# Altium schematic sheet 06_SAMA7G54-PIO.SchDoc
size 420 x 297 mm; SheetNumber: 28; SheetTotal: 29
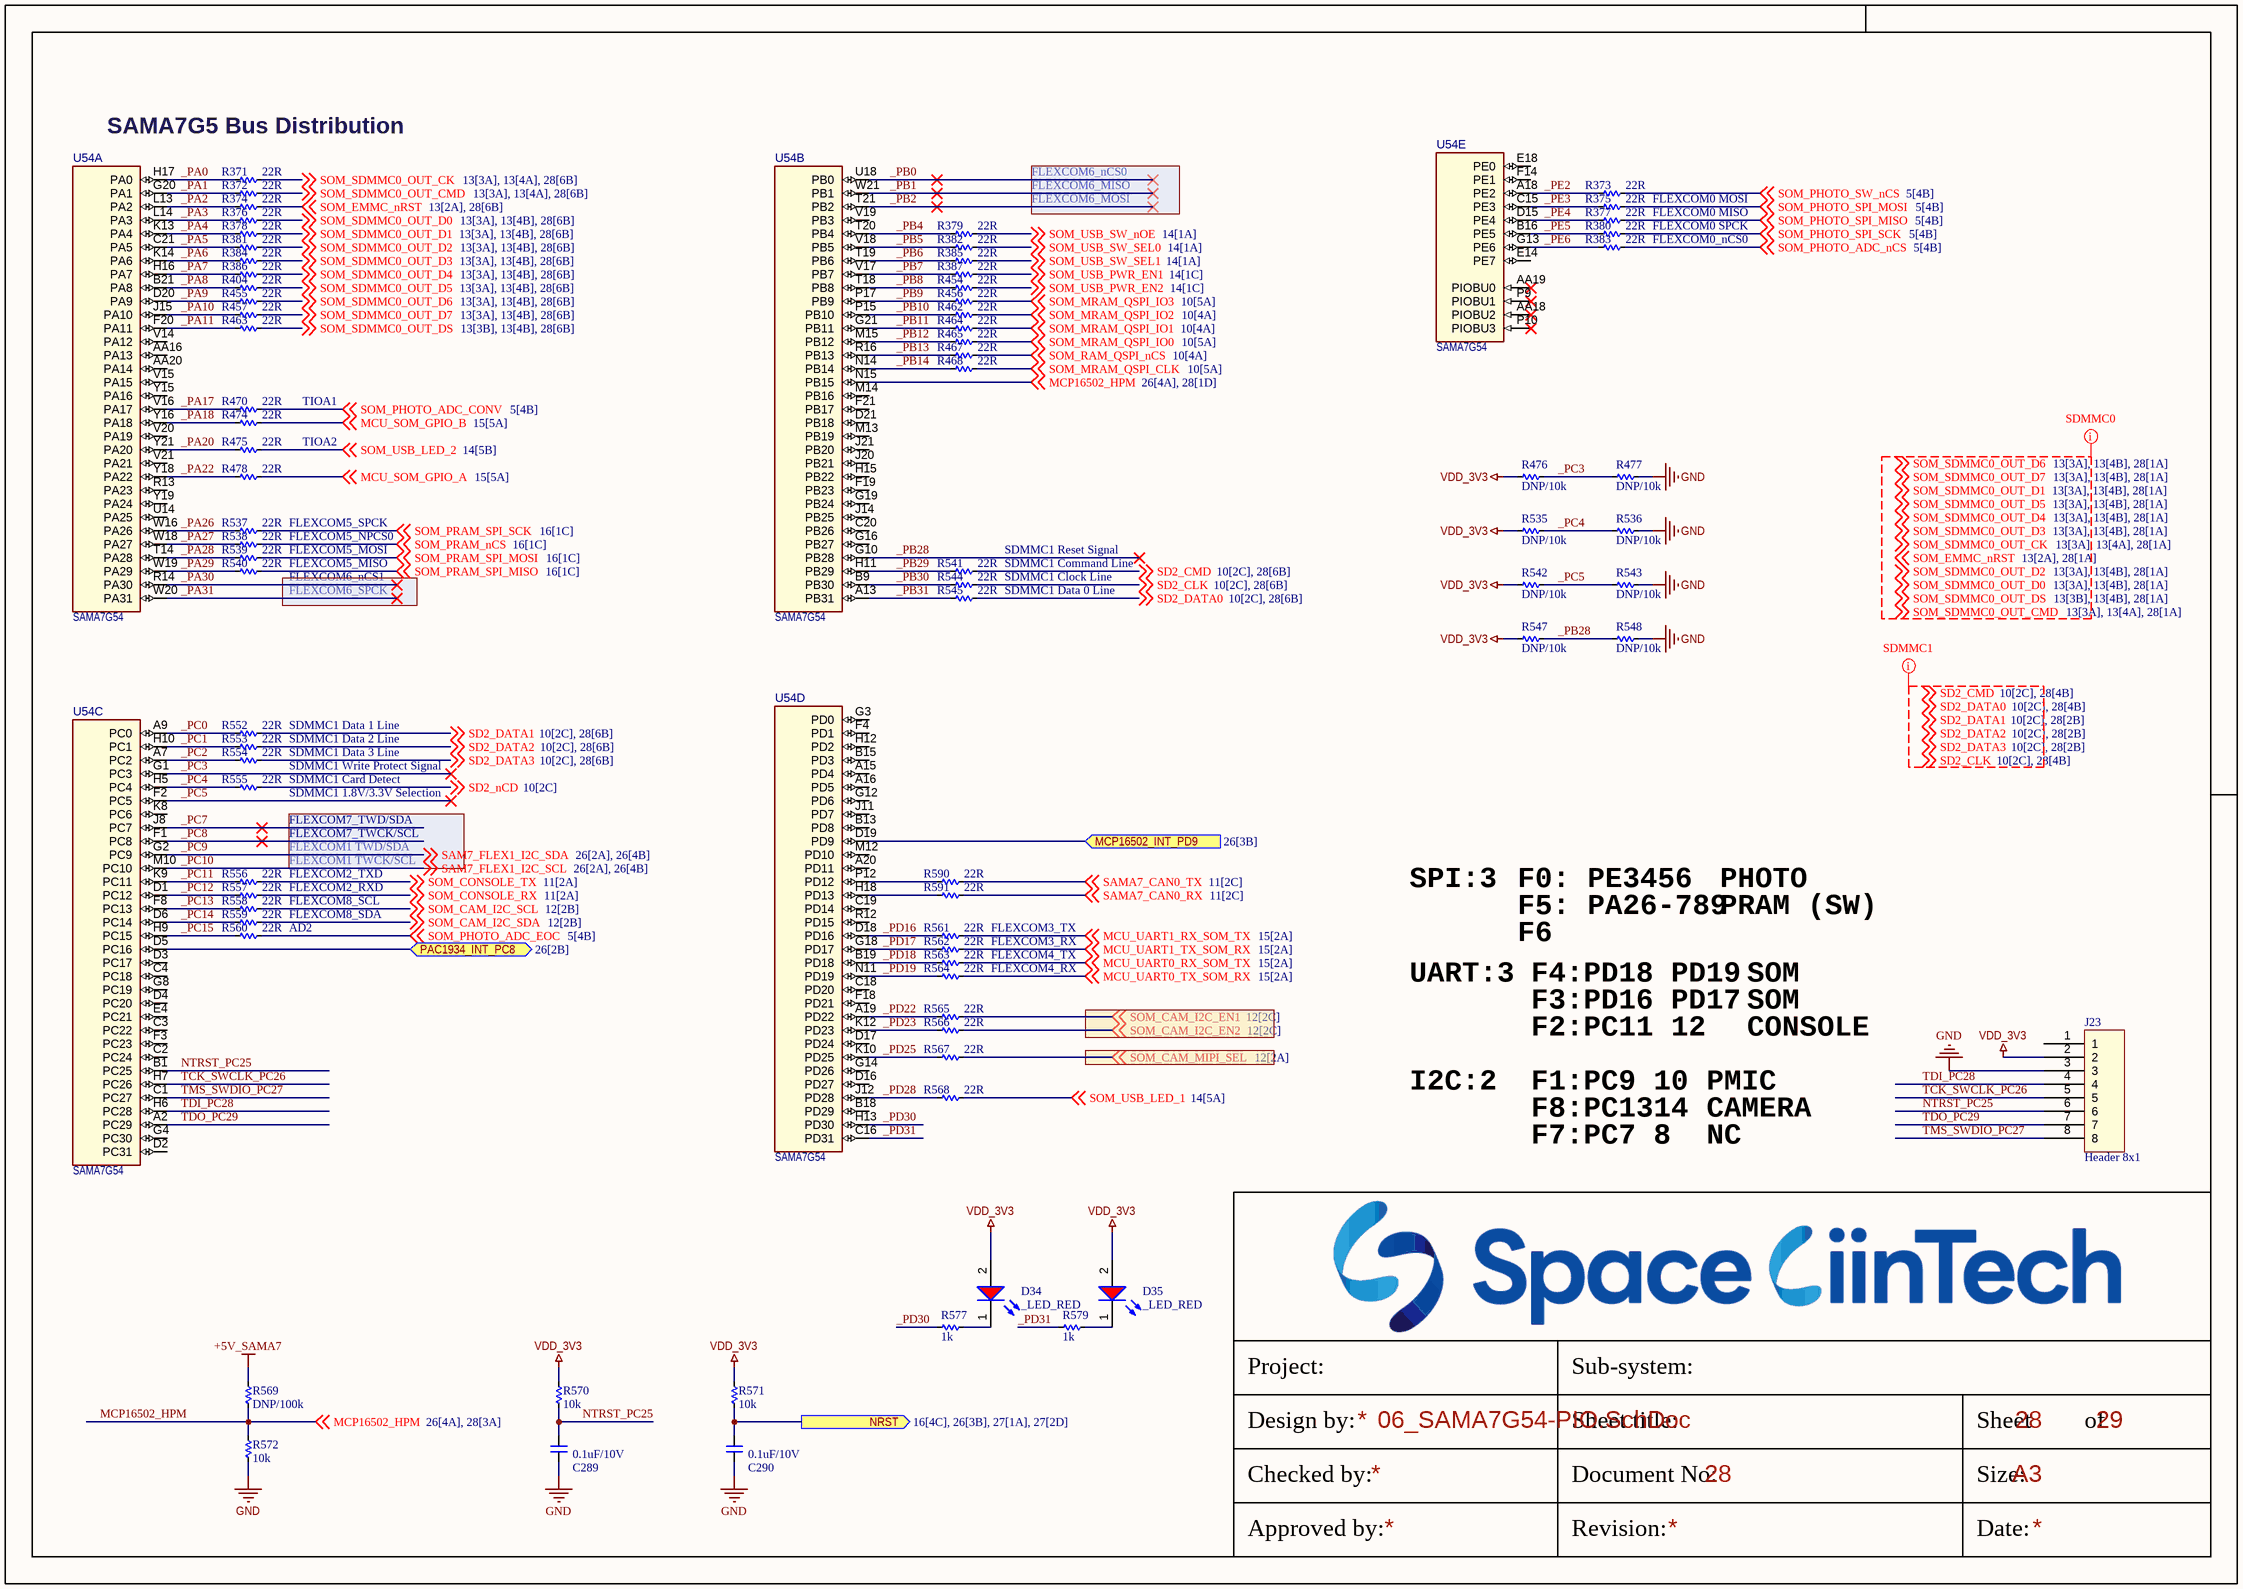
[diagram p0: 06_SAMA7G54-PIO.SchDoc]

## Parts
C289  0.1uF/10V  [CAP_C_1005X60]
C290  0.1uF/10V  [CAP_C_1005X60]
D34  _LED_RED  [LED_0603]
D35  _LED_RED  [LED_0603]
J23  Header 8x1  [Header_254P_8x1]
R371  22R  [RES_C_0603X30]
R372  22R  [RES_C_0603X30]
R373  22R  [RES_C_0603X30]
R374  22R  [RES_C_0603X30]
R375  22R  [RES_C_0603X30]
R376  22R  [RES_C_0603X30]
R377  22R  [RES_C_0603X30]
R378  22R  [RES_C_0603X30]
R379  22R  [RES_C_0603X30]
R380  22R  [RES_C_0603X30]
R381  22R  [RES_C_0603X30]
R382  22R  [RES_C_0603X30]
R383  22R  [RES_C_0603X30]
R384  22R  [RES_C_0603X30]
R385  22R  [RES_C_0603X30]
R386  22R  [RES_C_0603X30]
R387  22R  [RES_C_0603X30]
R404  22R  [RES_C_0603X30]
R454  22R  [RES_C_0603X30]
R455  22R  [RES_C_0603X30]
R456  22R  [RES_C_0603X30]
R457  22R  [RES_C_0603X30]
R462  22R  [RES_C_0603X30]
R463  22R  [RES_C_0603X30]
R464  22R  [RES_C_0603X30]
R465  22R  [RES_C_0603X30]
R467  22R  [RES_C_0603X30]
R468  22R  [RES_C_0603X30]
R470  22R  [RES_C_0603X30]
R474  22R  [RES_C_0603X30]
R475  22R  [RES_C_0603X30]
R476  DNP/10k  [RES_C_1005X40]
R477  DNP/10k  [RES_C_1005X40]
R478  22R  [RES_C_0603X30]
R535  DNP/10k  [RES_C_1005X40]
R536  DNP/10k  [RES_C_1005X40]
R537  22R  [RES_C_0603X30]
R538  22R  [RES_C_0603X30]
R539  22R  [RES_C_0603X30]
R540  22R  [RES_C_0603X30]
R541  22R  [RES_C_0603X30]
R542  DNP/10k  [RES_C_1005X40]
R543  DNP/10k  [RES_C_1005X40]
R544  22R  [RES_C_0603X30]
R545  22R  [RES_C_0603X30]
R547  DNP/10k  [RES_C_1005X40]
R548  DNP/10k  [RES_C_1005X40]
R552  22R  [RES_C_0603X30]
R553  22R  [RES_C_0603X30]
R554  22R  [RES_C_0603X30]
R555  22R  [RES_C_0603X30]
R556  22R  [RES_C_0603X30]
R557  22R  [RES_C_0603X30]
R558  22R  [RES_C_0603X30]
R559  22R  [RES_C_0603X30]
R560  22R  [RES_C_0603X30]
R561  22R  [RES_C_0603X30]
R562  22R  [RES_C_0603X30]
R563  22R  [RES_C_0603X30]
R564  22R  [RES_C_0603X30]
R565  22R  [RES_C_0603X30]
R566  22R  [RES_C_0603X30]
R567  22R  [RES_C_0603X30]
R568  22R  [RES_C_0603X30]
R569  DNP/100k  [RES_C_1005X40]
R570  10k  [RES_C_1005X40]
R571  10k  [RES_C_1005X40]
R572  10k  [RES_C_1005X40]
R577  1k  [RES_C_1005X40]
R579  1k  [RES_C_1005X40]
R590  22R  [RES_C_0603X30]
R591  22R  [RES_C_0603X30]
U54  SAMA7G54  [TFBGA-343_14x14]  (parts A,B,C,D,E of 8)

## Ports
MCP16502_INT_PD9 (in, see 26[3B]), NRST (out, see 16[4C], 26[3B], 27[1A], 27[2D]), PAC1934_INT_PC8 (bidir, see 26[2B])

## Nets
+5V_SAMA7: R569.1
GND: C289.1 C290.1 J23.3 R477.1 R536.1 R543.1 R548.1 R572.2
VDD_3V3: D34.2(A) D35.2(A) J23.2 R476.2 R535.2 R542.2 R547.2 R570.2 R571.2
_PA0: R371.2 U54.H17(PA0)
_PA1: R372.2 U54.G20(PA1)
_PA2: R374.2 U54.L13(PA2)
_PA3: R376.2 U54.L14(PA3)
_PA4: R378.2 U54.K13(PA4)
_PA5: R381.2 U54.C21(PA5)
_PA6: R384.2 U54.K14(PA6)
_PA7: R386.2 U54.H16(PA7)
_PA8: R404.2 U54.B21(PA8)
_PA9: R455.2 U54.D20(PA9)
_PA10: R457.2 U54.J15(PA10)
_PA11: R463.2 U54.F20(PA11)
_PA17: R470.2 U54.V16(PA17)
_PA18: R474.2 U54.Y16(PA18)
_PA20: R475.2 U54.Y21(PA20)
_PA22: R478.2 U54.Y18(PA22)
_PA26: R537.2 U54.W16(PA26)
_PA27: R538.2 U54.W18(PA27)
_PA28: R539.2 U54.T14(PA28)
_PA29: R540.2 U54.W19(PA29)
_PA30: U54.R14(PA30)
_PA31: U54.W20(PA31)
_PB0: U54.U18(PB0)
_PB1: U54.W21(PB1)
_PB2: U54.T21(PB2)
_PB4: R379.2 U54.T20(PB4)
_PB5: R382.2 U54.V18(PB5)
_PB6: R385.2 U54.T19(PB6)
_PB7: R387.2 U54.V17(PB7)
_PB8: R454.2 U54.T18(PB8)
_PB9: R456.2 U54.P17(PB9)
_PB10: R462.2 U54.P15(PB10)
_PB11: R464.2 U54.G21(PB11)
_PB12: R465.2 U54.M15(PB12)
_PB13: R467.2 U54.R16(PB13)
_PB14: R468.2 U54.N14(PB14)
_PB28: R547.1 R548.2 U54.G10(PB28)
_PB29: R541.2 U54.H11(PB29)
_PB30: R544.2 U54.B9(PB30)
_PB31: R545.2 U54.A13(PB31)
_PC0: R552.2 U54.A9(PC0)
_PC1: R553.2 U54.H10(PC1)
_PC2: R554.2 U54.A7(PC2)
_PC3: R476.1 R477.2 U54.G1(PC3)
_PC4: R535.1 R536.2 R555.2 U54.H5(PC4)
_PC5: R542.1 R543.2 U54.F2(PC5)
_PC7: U54.J8(PC7)
_PC8: U54.F1(PC8)
_PC9: U54.G2(PC9) ; off-sheet SAM7_FLEX1_I2C_SDA  [also labelled SAM7_FLEX1_I2C_SDA]
_PC10: U54.M10(PC10) ; off-sheet SAM7_FLEX1_I2C_SCL  [also labelled SAM7_FLEX1_I2C_SCL]
_PC11: R556.2 U54.K9(PC11)
_PC12: R557.2 U54.D1(PC12)
_PC13: R558.2 U54.F8(PC13)
_PC14: R559.2 U54.D6(PC14)
_PC15: R560.2 U54.H9(PC15)
_PD16: R561.2 U54.D18(PD16)
_PD17: R562.2 U54.G18(PD17)
_PD18: R563.2 U54.B19(PD18)
_PD19: R564.2 U54.N11(PD19)
_PD22: R565.2 U54.A19(PD22)
_PD23: R566.2 U54.K12(PD23)
_PD25: R567.2 U54.K10(PD25)
_PD28: R568.2 U54.J12(PD28)
_PD30: R577.1 U54.H13(PD30)
_PD31: R579.1 U54.C16(PD31)
_PE2: R373.2 U54.A18(PE2)
_PE3: R375.2 U54.C15(PE3)
_PE4: R377.2 U54.D15(PE4)
_PE5: R380.2 U54.B16(PE5)
_PE6: R383.2 U54.G13(PE6)
MCP16502_HPM: R569.2 R572.1 U54.N15(PB15) ; off-sheet MCP16502_HPM
MCP16502_INT_PD9: U54.D19(PD9) ; port MCP16502_INT_PD9
MCU_SOM_GPIO_A: R478.1 ; off-sheet MCU_SOM_GPIO_A
MCU_SOM_GPIO_B: R474.1 ; off-sheet MCU_SOM_GPIO_B
MCU_UART0_RX_SOM_TX: R563.1 ; off-sheet MCU_UART0_RX_SOM_TX
MCU_UART0_TX_SOM_RX: R564.1 ; off-sheet MCU_UART0_TX_SOM_RX
MCU_UART1_RX_SOM_TX: R561.1 ; off-sheet MCU_UART1_RX_SOM_TX
MCU_UART1_TX_SOM_RX: R562.1 ; off-sheet MCU_UART1_TX_SOM_RX
NRST: C290.2 R571.1 ; port NRST
NTRST_PC25: C289.2 J23.6 R570.1 U54.B1(PC25)
PAC1934_INT_PC8: U54.D5(PC16) ; port PAC1934_INT_PC8
SAMA7_CAN0_RX: R591.1 ; off-sheet SAMA7_CAN0_RX
SAMA7_CAN0_TX: R590.1 ; off-sheet SAMA7_CAN0_TX
SD2_CLK: R544.1 ; off-sheet SD2_CLK
SD2_CMD: R541.1 ; off-sheet SD2_CMD
SD2_DATA0: R545.1 ; off-sheet SD2_DATA0
SD2_DATA1: R552.1 ; off-sheet SD2_DATA1
SD2_DATA2: R553.1 ; off-sheet SD2_DATA2
SD2_DATA3: R554.1 ; off-sheet SD2_DATA3
SD2_nCD: R555.1 ; off-sheet SD2_nCD
SOM_CAM_I2C_EN1: R565.1 ; off-sheet SOM_CAM_I2C_EN1
SOM_CAM_I2C_EN2: R566.1 ; off-sheet SOM_CAM_I2C_EN2
SOM_CAM_I2C_SCL: R558.1 ; off-sheet SOM_CAM_I2C_SCL
SOM_CAM_I2C_SDA: R559.1 ; off-sheet SOM_CAM_I2C_SDA
SOM_CAM_MIPI_SEL: R567.1 ; off-sheet SOM_CAM_MIPI_SEL
SOM_CONSOLE_RX: R557.1 ; off-sheet SOM_CONSOLE_RX
SOM_CONSOLE_TX: R556.1 ; off-sheet SOM_CONSOLE_TX
SOM_EMMC_nRST: R374.1 ; off-sheet SOM_EMMC_nRST
SOM_MRAM_QSPI_CLK: R468.1 ; off-sheet SOM_MRAM_QSPI_CLK
SOM_MRAM_QSPI_IO0: R465.1 ; off-sheet SOM_MRAM_QSPI_IO0
SOM_MRAM_QSPI_IO1: R464.1 ; off-sheet SOM_MRAM_QSPI_IO1
SOM_MRAM_QSPI_IO2: R462.1 ; off-sheet SOM_MRAM_QSPI_IO2
SOM_MRAM_QSPI_IO3: R456.1 ; off-sheet SOM_MRAM_QSPI_IO3
SOM_PHOTO_ADC_CONV: R470.1 ; off-sheet SOM_PHOTO_ADC_CONV
SOM_PHOTO_ADC_EOC: R560.1 ; off-sheet SOM_PHOTO_ADC_EOC
SOM_PHOTO_ADC_nCS: R383.1 ; off-sheet SOM_PHOTO_ADC_nCS
SOM_PHOTO_SPI_MISO: R377.1 ; off-sheet SOM_PHOTO_SPI_MISO
SOM_PHOTO_SPI_MOSI: R375.1 ; off-sheet SOM_PHOTO_SPI_MOSI
SOM_PHOTO_SPI_SCK: R380.1 ; off-sheet SOM_PHOTO_SPI_SCK
SOM_PHOTO_SW_nCS: R373.1 ; off-sheet SOM_PHOTO_SW_nCS
SOM_PRAM_nCS: R538.1 ; off-sheet SOM_PRAM_nCS
SOM_PRAM_SPI_MISO: R540.1 ; off-sheet SOM_PRAM_SPI_MISO
SOM_PRAM_SPI_MOSI: R539.1 ; off-sheet SOM_PRAM_SPI_MOSI
SOM_PRAM_SPI_SCK: R537.1 ; off-sheet SOM_PRAM_SPI_SCK
SOM_RAM_QSPI_nCS: R467.1 ; off-sheet SOM_RAM_QSPI_nCS
SOM_SDMMC0_OUT_CK: R371.1 ; off-sheet SOM_SDMMC0_OUT_CK
SOM_SDMMC0_OUT_CMD: R372.1 ; off-sheet SOM_SDMMC0_OUT_CMD
SOM_SDMMC0_OUT_D0: R376.1 ; off-sheet SOM_SDMMC0_OUT_D0
SOM_SDMMC0_OUT_D1: R378.1 ; off-sheet SOM_SDMMC0_OUT_D1
SOM_SDMMC0_OUT_D2: R381.1 ; off-sheet SOM_SDMMC0_OUT_D2
SOM_SDMMC0_OUT_D3: R384.1 ; off-sheet SOM_SDMMC0_OUT_D3
SOM_SDMMC0_OUT_D4: R386.1 ; off-sheet SOM_SDMMC0_OUT_D4
SOM_SDMMC0_OUT_D5: R404.1 ; off-sheet SOM_SDMMC0_OUT_D5
SOM_SDMMC0_OUT_D6: R455.1 ; off-sheet SOM_SDMMC0_OUT_D6
SOM_SDMMC0_OUT_D7: R457.1 ; off-sheet SOM_SDMMC0_OUT_D7
SOM_SDMMC0_OUT_DS: R463.1 ; off-sheet SOM_SDMMC0_OUT_DS
SOM_USB_LED_1: R568.1 ; off-sheet SOM_USB_LED_1
SOM_USB_LED_2: R475.1 ; off-sheet SOM_USB_LED_2
SOM_USB_PWR_EN1: R387.1 ; off-sheet SOM_USB_PWR_EN1
SOM_USB_PWR_EN2: R454.1 ; off-sheet SOM_USB_PWR_EN2
SOM_USB_SW_nOE: R379.1 ; off-sheet SOM_USB_SW_nOE
SOM_USB_SW_SEL0: R382.1 ; off-sheet SOM_USB_SW_SEL0
SOM_USB_SW_SEL1: R385.1 ; off-sheet SOM_USB_SW_SEL1
TCK_SWCLK_PC26: J23.5 U54.H7(PC26)
TDI_PC28: J23.4 U54.H6(PC28)
TDO_PC29: J23.7 U54.A2(PC29)
TMS_SWDIO_PC27: J23.8 U54.C1(PC27)
NetD34_1: D34.1(K) R577.2
NetD35_1: D35.1(K) R579.2
NetR590_2: R590.2 U54.P12(PD12)
NetR591_2: R591.2 U54.H18(PD13)

Not connected (* = marked no-connect by the designer): J23 1; U54 A15(PD4) A16(PD5) A20(PD11) AA16(PA13) AA18(PIOBU2)* AA19(PIOBU0)* AA20(PA14) B13(PD8) B15(PD3) B18(PD29) C2(PC24) C3(PC22) C4(PC18) C18(PD20) C19(PD14) C20(PB26) D2(PC31) D3(PC17) D4(PC20) D16(PD27) D17(PD24) D21(PB18) E4(PC21) E14(PE7) E18(PE0) F3(PC23) F4(PD1) F14(PE1) F18(PD21) F19(PB23) F21(PB17) G3(PD0) G4(PC30) G8(PC19) G12(PD6) G14(PD26) G16(PB27) G19(PB24) H12(PD2) H15(PB22) J11(PD7) J14(PB25) J20(PB21) J21(PB20) K8(PC6) M12(PD10) M13(PB19) M14(PB16) P9(PIOBU1)* P10(PIOBU3)* R12(PD15) R13(PA23) U14(PA25) V14(PA12) V15(PA15) V19(PB3) V20(PA19) V21(PA21) Y15(PA16) Y19(PA24)

## Layout directives
net class SDMMC1: SD2_CLK, SD2_CMD, SD2_DATA0, SD2_DATA1, SD2_DATA2, SD2_DATA3
net class SDMMC0: SOM_EMMC_nRST, SOM_SDMMC0_OUT_CK, SOM_SDMMC0_OUT_CMD, SOM_SDMMC0_OUT_D0, SOM_SDMMC0_OUT_D1, SOM_SDMMC0_OUT_D2, SOM_SDMMC0_OUT_D3, SOM_SDMMC0_OUT_D4, SOM_SDMMC0_OUT_D5, SOM_SDMMC0_OUT_D6, SOM_SDMMC0_OUT_D7, SOM_SDMMC0_OUT_DS

## Notes on the sheet
- SAMA7G5 Bus Distribution
- FLEXCOM6_MISO
- FLEXCOM6_nCS0
- FLEXCOM6_MOSI
- FLEXCOM0 MISO
- FLEXCOM0_nCS0
- FLEXCOM0 SPCK
- FLEXCOM0 MOSI
- TIOA1
- TIOA2
- FLEXCOM5_SPCK
- FLEXCOM6_SPCK
- FLEXCOM6_nCS1
- FLEXCOM5_NPCS0
- FLEXCOM5_MOSI
- FLEXCOM5_MISO
- SDMMC1 Reset Signal
- SDMMC1 Command Line
- SDMMC1 Data 0 Line
- SDMMC1 Clock Line
- SDMMC1 Data 1 Line
- SDMMC1 Data 2 Line
- SDMMC1 Data 3 Line
- SDMMC1 Write Protect Signal
- SDMMC1 Card Detect
- SDMMC1 1.8V/3.3V Selection
- FLEXCOM1 TWD/SDA
- FLEXCOM1 TWCK/SCL
- FLEXCOM7_TWD/SDA
- FLEXCOM7_TWCK/SCL
- AD2
- FLEXCOM8_SCL
- FLEXCOM8_SDA
- FLEXCOM2_TXD
- FLEXCOM2_RXD
- FLEXCOM3_TX
- SPI:3
- F0: PE3456
- F5: PA26-789
- PHOTO
- PRAM (SW)
- FLEXCOM3_RX
- FLEXCOM4_TX
- FLEXCOM4_RX
- UART:3
- F6
- F4:PD18 PD19
- SOM
- F3:PD16 PD17
- F2:PC11 12
- CONSOLE
- I2C:2
- F1:PC9 10
- F8:PC1314
- PMIC
- CAMERA
- F7:PC7 8
- NC
- Labels drawn without touching a wire or pin: SD2_CLK, SD2_CMD, SD2_DATA0, SD2_DATA1, SD2_DATA2, SD2_DATA3, SOM_EMMC_nRST, SOM_SDMMC0_OUT_CK, SOM_SDMMC0_OUT_CMD, SOM_SDMMC0_OUT_D0, SOM_SDMMC0_OUT_D1, SOM_SDMMC0_OUT_D2, SOM_SDMMC0_OUT_D3, SOM_SDMMC0_OUT_D4, SOM_SDMMC0_OUT_D5, SOM_SDMMC0_OUT_D6, SOM_SDMMC0_OUT_D7, SOM_SDMMC0_OUT_DS
- Project:
- Sub-system:
- Design by:
- Sheet title:
- Sheet
- of
- Checked by:
- Approved by:
- Revision:
- Document No:
- Size:
- Date:
- A3

## Library data of the parts
C289 C290 = _CAP_C_2: CAP CHIP
R371-R387 R404 R454-R457 R462-R465 R467 R468 R470 R474-R478 R535-R545 R547 R548 R552-R572 R577 R579 R590 R591 = _RES_B_2: RES
U54 = MIC8923: SAMA7G54 MPU 1000MHz Cortex-A7 TFBGA-343; Manufacturer Part Number 1: SAMA7G54-V/4HB; Manufacturer 1: Microchip; Description_: MCHP MPU 32-BIT Cortex-A7 1000MHz 128kB SAMA7G54-V/4HB TFBGA-343; Populated: YES; Dev Tools Status: Design; Owner: Ciprian Abramov; Package: TFBGA-343; MCHP-ID: MIC8923; Value: SAMA7G54; Symbol: SAMA7G54 TFBGA-343; Type: 32-Bit MPU; Status: MCL Design; Revision: 1; Category: MCHP-Microcontroller; ComponentLink1Description: SVN Datasheet; ComponentLink2Description: Local Datasheet; ComponentLink3URL: C:\ALTIUM_WORK\00001_MCHP-CDB\Library\LibraryRefs\SAMA7G54 TFBGA-343.SchLib; ComponentLink3Description: Open Symbol; ComponentLink4URL: C:\ALTIUM_WORK\00001_MCHP-CDB\Library\Footprints\TFBGA-343_14x14.PcbLib; ComponentLink4Description: Open Footprint; ComponentLink5Description: Open Footprint 2; ComponentLink6Description: Open Footprint 3; ComponentLink7Description: Open Footprint 4; Supplier 1: Microchip; Supplier Part Number 1: SAMA7G54-V/4HB; Quantity Override: 1